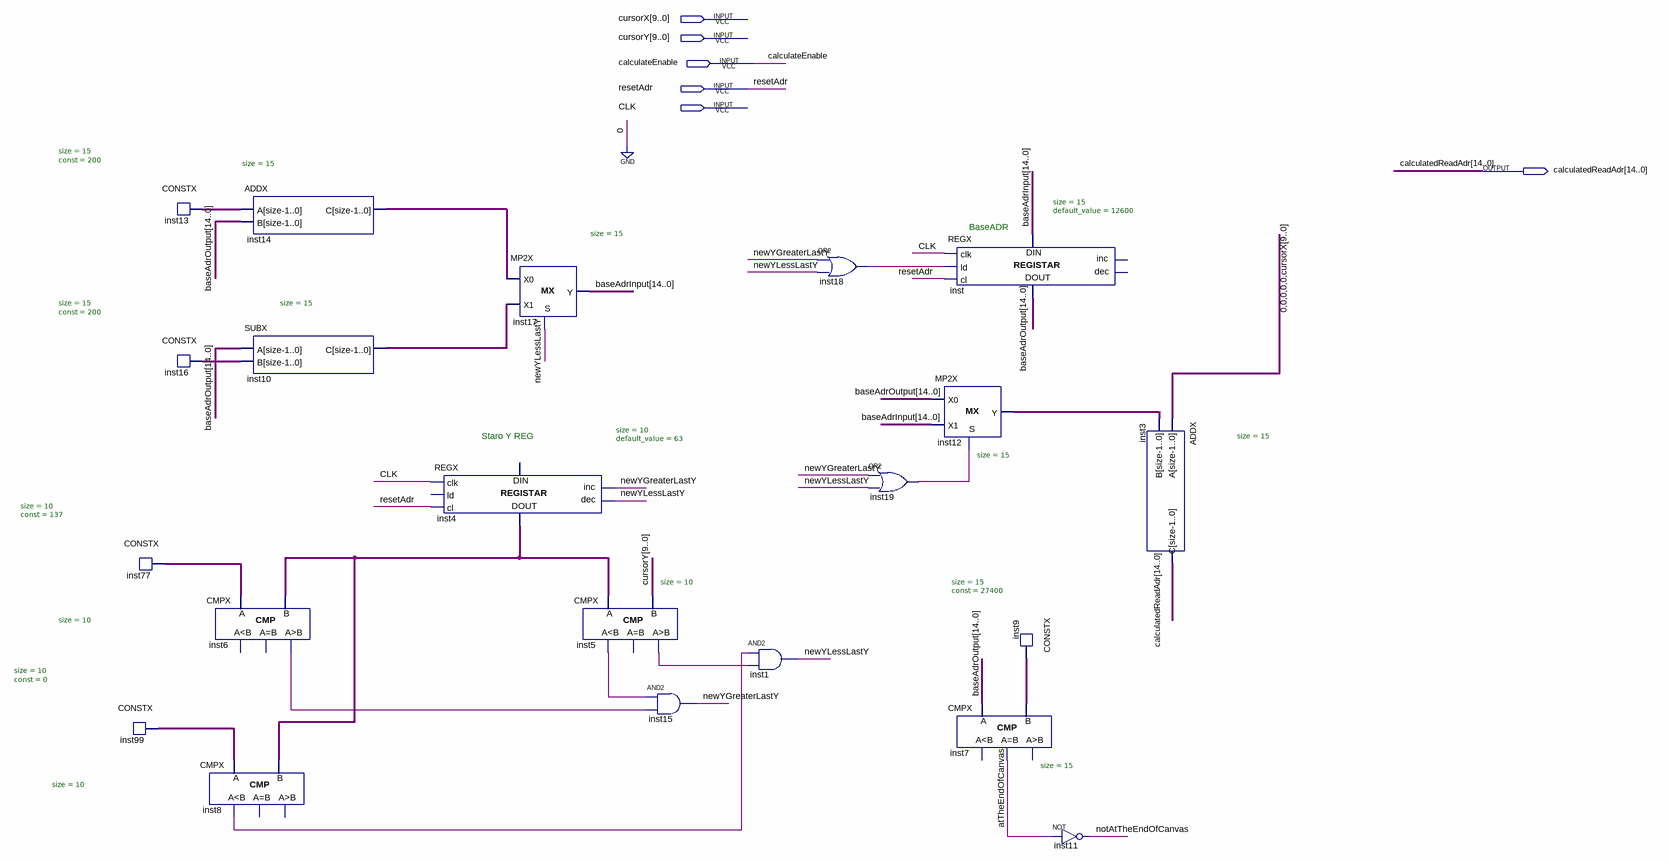
[diagram p0: schematic sheet]
// Quartus schematic CalculatedWriteAdr.bdf as structural Verilog: 21 symbols, 6 pins
module CalculatedWriteAdr (
  input  [9:0] cursorX,
  input  [9:0] cursorY,
  input  calculateEnable,
  input  resetAdr,
  input  CLK,
  output [14:0] calculatedReadAdr
);

  wire atTheEndOfCanvas, inst5_gr, inst5_ls, inst6_gr, inst8_ls, inst18_out, inst19_out, newYGreaterLastY,
       newYLessLastY, notAtTheEndOfCanvas;
  wire [9:0] inst4_data_out, inst77_data, inst99_data;
  wire [14:0] baseAdrInput, baseAdrOutput, inst9_data, inst10_c, inst12_y, inst13_data, inst14_c, inst16_data;

  CONSTX #(.size(10), .\const (137)) inst77 (.data(inst77_data));
  CONSTX #(.size(10), .\const (0)) inst99 (.data(inst99_data));
  CONSTX #(.size(15), .\const (200)) inst13 (.data(inst13_data));
  CONSTX #(.size(15), .\const (200)) inst16 (.data(inst16_data));
  CMPX #(.size(10)) inst8 (.A(inst99_data), .B(inst4_data_out), .ls(inst8_ls));  // open: eq, gr
  ADDX #(.size(15)) inst14 (.A(inst13_data), .B(baseAdrOutput), .C(inst14_c));
  SUBX #(.size(15)) inst10 (.A(baseAdrOutput), .B(inst16_data), .C(inst10_c));
  CMPX #(.size(10)) inst6 (.A(inst77_data), .B(inst4_data_out), .gr(inst6_gr));  // open: ls, eq
  REGX #(.size(10), .default_value(63)) inst4 (
    .clk(CLK), .cl(resetAdr), .inc(newYGreaterLastY), .dec(newYLessLastY), .data_out(inst4_data_out));  // open: ld, data_in
  MP2X #(.size(15)) inst17 (.S(newYLessLastY), .X0(inst14_c), .X1(inst10_c), .Y(baseAdrInput));
  CMPX #(.size(10)) inst5 (.A(inst4_data_out), .B(cursorY), .ls(inst5_ls), .gr(inst5_gr));  // open: eq
  and inst15 (newYGreaterLastY, inst5_ls, inst6_gr);
  and inst1 (newYLessLastY, inst8_ls, inst5_gr);
  or inst18 (inst18_out, newYGreaterLastY, newYLessLastY);
  or inst19 (inst19_out, newYGreaterLastY, newYLessLastY);
  REGX #(.size(15), .default_value(12600)) inst (
    .clk(CLK), .ld(inst18_out), .cl(resetAdr), .data_in(baseAdrInput), .data_out(baseAdrOutput));  // open: inc, dec
  MP2X #(.size(15)) inst12 (.S(inst19_out), .X0(baseAdrOutput), .X1(baseAdrInput), .Y(inst12_y));
  CMPX #(.size(15)) inst7 (.A(baseAdrOutput), .B(inst9_data), .eq(atTheEndOfCanvas));  // open: ls, gr
  CONSTX #(.size(15), .\const (27400)) inst9 (.data(inst9_data));
  not inst11 (notAtTheEndOfCanvas, atTheEndOfCanvas);
  ADDX #(.size(15)) inst3 (.A({{5{1'b0}}, cursorX}), .B(inst12_y), .C(calculatedReadAdr));

  // Notes on the sheet:
  //   BaseADR
  //   Staro Y REG
endmodule
